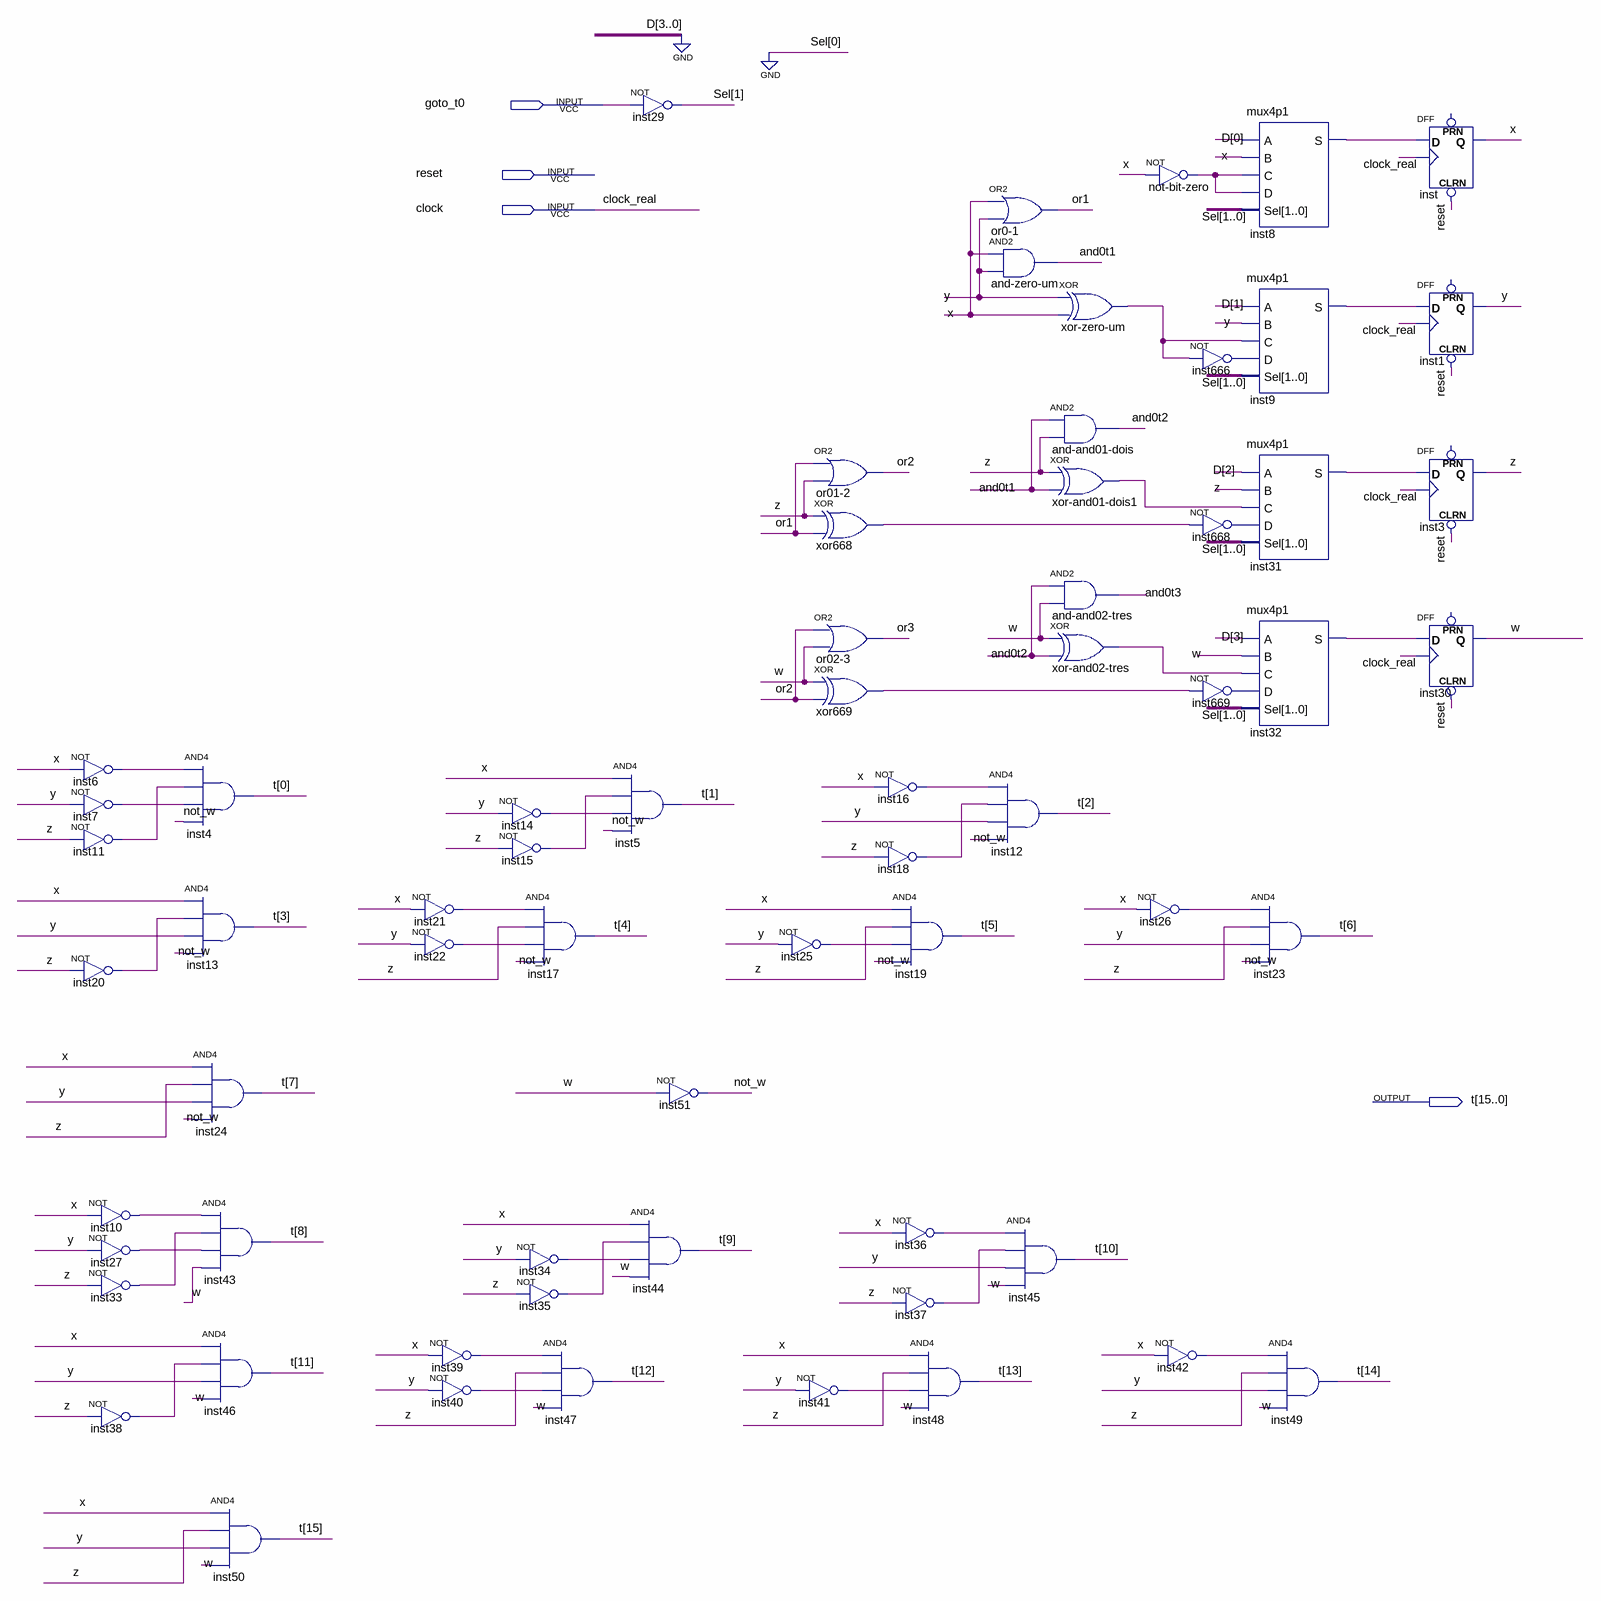
[diagram p0: schematic sheet]
// Quartus schematic timerNEANDER.bdf as structural Verilog: 65 symbols, 4 pins
module timerNEANDER (
  input  goto_t0,
  input  reset,
  input  clock,
  output [15:0] t
);

  wire and0t1, and0t2, and0t3, inst6_out, inst7_out, inst8_s, inst9_s, inst10_out, inst11_out, inst14_out,
       inst15_out, inst16_out, inst18_out, inst20_out, inst21_out, inst22_out, inst25_out, inst26_out,
       inst27_out, inst31_s, inst32_s, inst33_out, inst34_out, inst35_out, inst36_out, inst37_out,
       inst38_out, inst39_out, inst40_out, inst41_out, inst42_out, inst666_out, inst668_out, inst669_out,
       not_bit_zero_out, not_w, or1, or2, or3, w, x, xor668_out, xor669_out, xor_and01_dois1_out,
       xor_and02_tres_out, xor_zero_um_out, y, z;
  wire [1:1] Sel;

  not inst6 (inst6_out, x);
  not inst7 (inst7_out, y);
  not inst11 (inst11_out, z);
  not inst20 (inst20_out, z);
  not inst10 (inst10_out, x);
  not inst27 (inst27_out, y);
  not inst33 (inst33_out, z);
  not inst38 (inst38_out, z);
  and inst4 (t[0], inst6_out, inst11_out, inst7_out, not_w);
  and inst13 (t[3], x, inst20_out, y, not_w);
  and inst24 (t[7], x, z, y, not_w);
  and inst43 (t[8], inst10_out, inst33_out, inst27_out, w);
  and inst46 (t[11], x, inst38_out, y, w);
  and inst50 (t[15], x, z, y, w);
  not inst21 (inst21_out, x);
  not inst22 (inst22_out, y);
  not inst39 (inst39_out, x);
  not inst40 (inst40_out, y);
  not inst14 (inst14_out, y);
  not inst15 (inst15_out, z);
  and inst17 (t[4], inst21_out, z, inst22_out, not_w);
  not inst34 (inst34_out, y);
  not inst35 (inst35_out, z);
  and inst47 (t[12], inst39_out, z, inst40_out, w);
  not inst29 (Sel[1], goto_t0);
  and inst5 (t[1], x, inst15_out, inst14_out, not_w);
  and inst44 (t[9], x, inst35_out, inst34_out, w);
  not inst51 (not_w, w);
  not inst25 (inst25_out, y);
  or \or01-2  (or2, or1, z);
  xor xor668 (xor668_out, z, or1);
  or \or02-3  (or3, or2, w);
  xor xor669 (xor669_out, w, or2);
  not inst41 (inst41_out, y);
  not inst16 (inst16_out, x);
  not inst18 (inst18_out, z);
  and inst19 (t[5], x, z, inst25_out, not_w);
  not inst36 (inst36_out, x);
  not inst37 (inst37_out, z);
  and inst48 (t[13], x, z, inst41_out, w);
  or \or0-1  (or1, x, y);
  and \and-zero-um  (and0t1, x, y);
  and inst12 (t[2], inst16_out, inst18_out, y, not_w);
  xor \xor-zero-um  (xor_zero_um_out, y, x);
  and \and-and01-dois  (and0t2, and0t1, z);
  xor \xor-and01-dois1  (xor_and01_dois1_out, z, and0t1);
  and \and-and02-tres  (and0t3, and0t2, w);
  xor \xor-and02-tres  (xor_and02_tres_out, w, and0t2);
  and inst45 (t[10], inst36_out, inst37_out, y, w);
  not inst26 (inst26_out, x);
  not \not-bit-zero  (not_bit_zero_out, x);
  not inst666 (inst666_out, xor_zero_um_out);
  not inst668 (inst668_out, xor668_out);
  not inst669 (inst669_out, xor669_out);
  not inst42 (inst42_out, x);
  mux4p1 inst8 (.A(1'b0), .B(x), .C(not_bit_zero_out), .D(not_bit_zero_out), .Sel({Sel[1], 1'b0}), .S(inst8_s));
  mux4p1 inst9 (.A(1'b0), .B(y), .C(xor_zero_um_out), .D(inst666_out), .Sel({Sel[1], 1'b0}), .S(inst9_s));
  mux4p1 inst31 (.A(1'b0), .B(z), .C(xor_and01_dois1_out), .D(inst668_out), .Sel({Sel[1], 1'b0}), .S(inst31_s));
  mux4p1 inst32 (.A(1'b0), .B(w), .C(xor_and02_tres_out), .D(inst669_out), .Sel({Sel[1], 1'b0}), .S(inst32_s));
  and inst23 (t[6], inst26_out, z, y, not_w);
  and inst49 (t[14], inst42_out, z, y, w);
  DFF inst (.CLRN(reset), .CLK(clock), .D(inst8_s), .Q(x));  // open: PRN
  DFF inst1 (.CLRN(reset), .CLK(clock), .D(inst9_s), .Q(y));  // open: PRN
  DFF inst3 (.CLRN(reset), .CLK(clock), .D(inst31_s), .Q(z));  // open: PRN
  DFF inst30 (.CLRN(reset), .CLK(clock), .D(inst32_s), .Q(w));  // open: PRN

  // Other names for the same wires on the sheet: clock_real = clock
endmodule
